# EAGLE schematic rpi2caster-eagle (EAGLE 7.2.0)
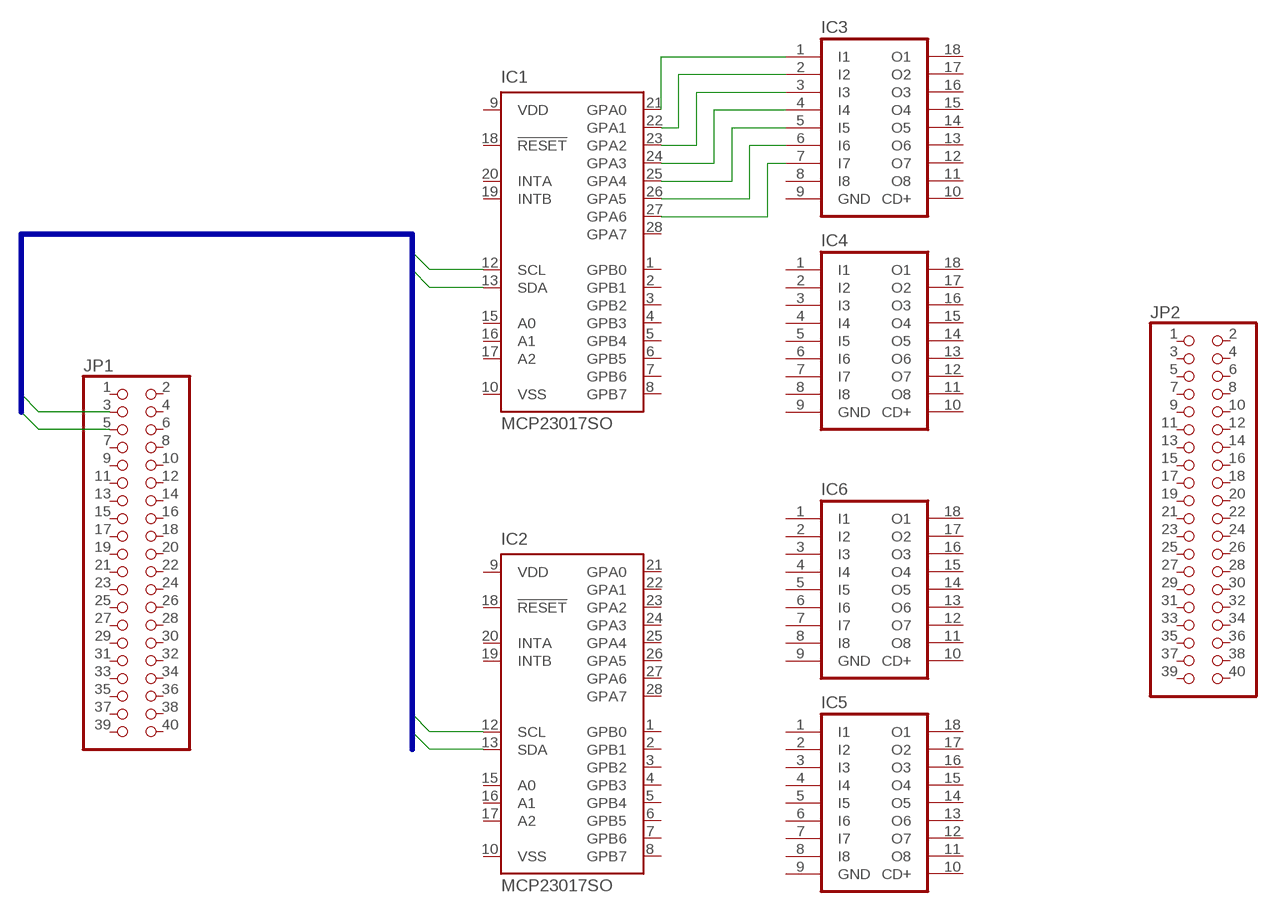
[diagram p0: schematic, sheet 1]

## Parts
IC1  MCP23017SO  [SO28W]
IC2  MCP23017SO  [SO28W]
IC3  ULN2803A  [DIL18]
IC4  ULN2803A  [DIL18]
IC5  ULN2803A  [DIL18]
IC6  ULN2803A  [DIL18]
JP1  PINHD-2X20  [2X20]
JP2  PINHD-2X20/90  [2X20/90]

## Nets
B$1: IC1.12(SCL) IC1.13(SDA) IC2.12(SCL) IC2.13(SDA) JP1.3 JP1.5
N$1: IC1.21(GPA0) IC3.1(I1)
N$2: IC1.22(GPA1) IC3.2(I2)
N$3: IC1.23(GPA2) IC3.3(I3)
N$4: IC1.24(GPA3) IC3.4(I4)
N$5: IC1.25(GPA4) IC3.5(I5)
N$6: IC1.26(GPA5) IC3.6(I6)
N$7: IC1.27(GPA6) IC3.7(I7)
Unconnected: IC1.1(GPB0) IC1.2(GPB1) IC1.3(GPB2) IC1.4(GPB3) IC1.5(GPB4) IC1.6(GPB5) IC1.7(GPB6) IC1.8(GPB7) IC1.15(A0) IC1.16(A1) IC1.17(A2) IC1.18(!RESET) IC1.19(INTB) IC1.20(INTA) IC1.28(GPA7) IC2.1(GPB0) IC2.2(GPB1) IC2.3(GPB2) IC2.4(GPB3) IC2.5(GPB4) IC2.6(GPB5) IC2.7(GPB6) IC2.8(GPB7) IC2.15(A0) IC2.16(A1) IC2.17(A2) IC2.18(!RESET) IC2.19(INTB) IC2.20(INTA) IC2.21(GPA0) IC2.22(GPA1) IC2.23(GPA2) IC2.24(GPA3) IC2.25(GPA4) IC2.26(GPA5) IC2.27(GPA6) IC2.28(GPA7) IC3.8(I8) IC3.10(CD+) IC3.11(O8) IC3.12(O7) IC3.13(O6) IC3.14(O5) IC3.15(O4) IC3.16(O3) IC3.17(O2) IC3.18(O1) IC4.1(I1) IC4.2(I2) IC4.3(I3) IC4.4(I4) IC4.5(I5) IC4.6(I6) IC4.7(I7) IC4.8(I8) IC4.10(CD+) IC4.11(O8) IC4.12(O7) IC4.13(O6) IC4.14(O5) IC4.15(O4) IC4.16(O3) IC4.17(O2) IC4.18(O1) IC5.1(I1) IC5.2(I2) IC5.3(I3) IC5.4(I4) IC5.5(I5) IC5.6(I6) IC5.7(I7) IC5.8(I8) IC5.10(CD+) IC5.11(O8) IC5.12(O7) IC5.13(O6) IC5.14(O5) IC5.15(O4) IC5.16(O3) IC5.17(O2) IC5.18(O1) IC6.1(I1) IC6.2(I2) IC6.3(I3) IC6.4(I4) IC6.5(I5) IC6.6(I6) IC6.7(I7) IC6.8(I8) IC6.10(CD+) IC6.11(O8) IC6.12(O7) IC6.13(O6) IC6.14(O5) IC6.15(O4) IC6.16(O3) IC6.17(O2) IC6.18(O1) JP1.1 JP1.2 JP1.4 JP1.6 JP1.7 JP1.8 JP1.9 JP1.10 JP1.11 JP1.12 JP1.13 JP1.14 JP1.15 JP1.16 JP1.17 JP1.18 JP1.19 JP1.20 JP1.21 JP1.22 JP1.23 JP1.24 JP1.25 JP1.26 JP1.27 JP1.28 JP1.29 JP1.30 JP1.31 JP1.32 JP1.33 JP1.34 JP1.35 JP1.36 JP1.37 JP1.38 JP1.39 JP1.40 JP2.1 JP2.2 JP2.3 JP2.4 JP2.5 JP2.6 JP2.7 JP2.8 JP2.9 JP2.10 JP2.11 JP2.12 JP2.13 JP2.14 JP2.15 JP2.16 JP2.17 JP2.18 JP2.19 JP2.20 JP2.21 JP2.22 JP2.23 JP2.24 JP2.25 JP2.26 JP2.27 JP2.28 JP2.29 JP2.30 JP2.31 JP2.32 JP2.33 JP2.34 JP2.35 JP2.36 JP2.37 JP2.38 JP2.39 JP2.40

## Buses
B$1

## Power pins joined to a net without a drawn wire
GND: IC3.9(GND) IC4.9(GND) IC5.9(GND) IC6.9(GND)
VDD: IC1.9(VDD) IC2.9(VDD)
VSS: IC1.10(VSS) IC2.10(VSS)

## Library data of the parts
IC1 IC2 = microchip:MCP23017: http://ww1.microchip.com/downloads/en/DeviceDoc/21952a.pdf Source: http://ww1.microchip.com/downloads/en/DeviceDoc/21952a.pdf; MF: MICROCHIP; MPN: MCP23017-E/SO; OC_FARNELL: 1332087; OC_NEWARK: 31K2958
IC3-IC6 = uln-udn:ULN2803A: DRIVER ARRAY
JP1 JP2 = pinhead:PINHD-2X20: PIN HEADER